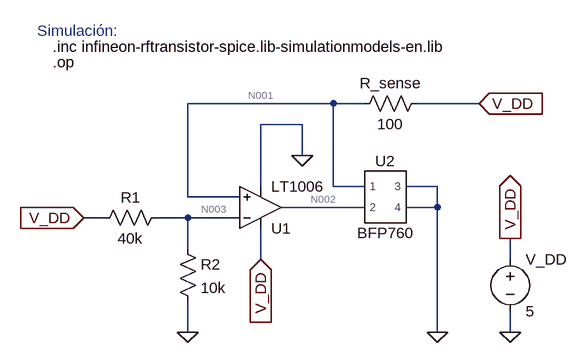
[diagram p0: schematic TP2 - Idea N1 con OPAMP.asc]
TP2 - Idea N1 con OPAMP.asc, the LTspice schematic file:
Version 4
SHEET 1 912 680
WIRE 256 160 32 160
WIRE 304 160 256 160
WIRE 480 160 384 160
WIRE 208 192 144 192
WIRE 208 240 208 192
WIRE 144 288 144 192
WIRE 256 288 256 160
WIRE 304 288 256 288
WIRE 416 288 368 288
WIRE 32 304 32 160
WIRE 112 304 32 304
WIRE 304 320 176 320
WIRE 416 320 416 288
WIRE 416 320 368 320
WIRE -96 336 -128 336
WIRE 32 336 -16 336
WIRE 112 336 32 336
WIRE 32 384 32 336
WIRE 144 400 144 352
WIRE 528 400 528 368
WIRE 32 512 32 464
WIRE 416 512 416 320
WIRE 528 512 528 480
FLAG 416 512 0
FLAG 480 160 V_DD
IOPIN 480 160 In
FLAG 32 512 0
FLAG 208 240 0
FLAG 528 512 0
FLAG 528 368 V_DD
IOPIN 528 368 Out
FLAG -128 336 V_DD
IOPIN -128 336 In
FLAG 144 400 V_DD
IOPIN 144 400 In
SYMBOL OpAmps\\LT1006 144 384 M180
SYMATTR InstName U1
SYMBOL res 400 144 R90
WINDOW 0 0 56 VBottom 2
WINDOW 3 32 56 VTop 2
SYMATTR InstName R_sense
SYMATTR Value 100
SYMBOL voltage 528 384 R0
SYMATTR InstName V_DD
SYMATTR Value 5
SYMBOL res 0 320 R90
WINDOW 0 0 56 VBottom 2
WINDOW 3 32 56 VTop 2
SYMATTR InstName R1
SYMATTR Value 40k
SYMBOL res 16 368 R0
SYMATTR InstName R2
SYMATTR Value 10k
SYMBOL BFP760 336 304 R0
SYMATTR InstName U2
TEXT -200 48 Left 2 ;Simulación:
TEXT -176 96 Left 2 !.op
TEXT -176 72 Left 2 !.inc infineon-rftransistor-spice.lib-simulationmodels-en.lib

The netlist it stands for:
* TP2 - Idea N1 con OPAMP.asc
XU1 N001 N003 V_DD 0 N002 LT1006  ; pins In+ In- V+ V- OUT
R_sense V_DD N001 100
V_DD V_DD 0 5
R1 N003 V_DD 40k
R2 N003 0 10k
XU2 N001 N002 0 0 BFP760  ; pins 1 2 3 4
* Simulación:
.op
.inc infineon-rftransistor-spice.lib-simulationmodels-en.lib
.lib LTC.lib
.lib C:\Users\Ernesto\Desktop\Ingeniería Electrónica\9- Noveno Semestre\Electrónica Analógica III\TP2 - Amplificador de Microondas\Archivos de la Simulación\Fuente de Corriente en LTSpice\Idea N°1 - OPAMP\infineon-rftransistor-spice.lib-simulationmodels-en.lib
.backanno
.end

* Results of the author's LTspice run, read from the files saved beside the schematic
* Operating Point:
*   V(n003) = 1 V
*   V(n001) = 1 V
*   V(v_dd) = 5 V
*   V(n002) = 827.3 mV
*   I(R_sense) = 40 mA
*   I(R1) = -100 µA
*   I(R2) = 100 µA
*   I(V_dd) = -40.56 mA
*   Ix(u1:1) = -10.42 nA
*   Ix(u1:2) = -10.42 nA
*   Ix(u1:3) = 461.8 µA
*   Ix(u1:4) = -288.3 µA
*   Ix(u1:5) = -173.5 µA
*   Ix(u2:1) = 40 mA
*   Ix(u2:2) = 173.5 µA
*   Ix(u2:3) = -20.09 mA
*   Ix(u2:4) = -20.09 mA
* From the log:
*   Semiconductor Device Operating Points:
*                           --- Diodes ---
*   Name:    d:u1:2      d:u1:3      d:u1:4      d:u1:5      d:u1:1
*   Model:  u1:dbias    u1:dbias      u1:xu       u1:xd       u1:yu
*   Id:     -1.03e-08   -1.03e-08   -8.32e-11   -1.68e-11    1.46e-14
*   Vd:     -4.00e+00   -4.00e+00   -4.16e+00   -8.42e-01    1.46e-02
*   Req:     1.00e+12    1.00e+12    2.00e-11    2.00e-11    1.00e-12
*   CAP:     0.00e+00    0.00e+00    0.00e+00    0.00e+00    0.00e+00
*   Name:    d:u1:6
*   Model:    u1:yd
*   Id:     -1.46e-14
*   Vd:     -1.46e-02
*   Req:     1.00e-12
*   CAP:     0.00e+00
*                           --- Bipolar Transistors ---
*   Name:     q:u2:1
*   Model:  u2:m_bfp760
*   Ib:       1.73e-04
*   Ic:       4.00e-02
*   Vbe:      8.27e-01
*   Vbc:     -1.73e-01
*   Vce:      1.00e+00
*   BetaDC:   2.31e+02
*   Gm:       1.10e+00
*   Rpi:      1.50e+02
*   Rx:       2.68e+00
*   Ro:       6.85e+03
*   Cbe:      2.94e-12
*   Cbc:      1.15e-13
*   Cjs:      2.20e-13
*   BetaAC:   1.65e+02
*   Cbx:      4.94e-14
*   Ft:       5.66e+10
*                           --- VDMOSFET Transistors ---
*   Name:        m:u1:1      m:u1:2
*   Model:        u1:n        u1:p
*   Id:          4.62e-04   -2.88e-04
*   Vgs:         1.46e-02    1.46e-02
*   Vds:         4.17e+00   -8.27e-01
*   Vth:        -1.22e-01    1.23e-01
*   Gm:          6.76e-03    5.34e-03
*   Gds:         0.00e+00    0.00e+00
*   Cgs:         0.00e+00    0.00e+00
*   Cgd:         0.00e+00    0.00e+00
*   Cbody:       0.00e+00    0.00e+00